# Altium schematic sheet Audio.SchDoc
size A4; Revision: B.2
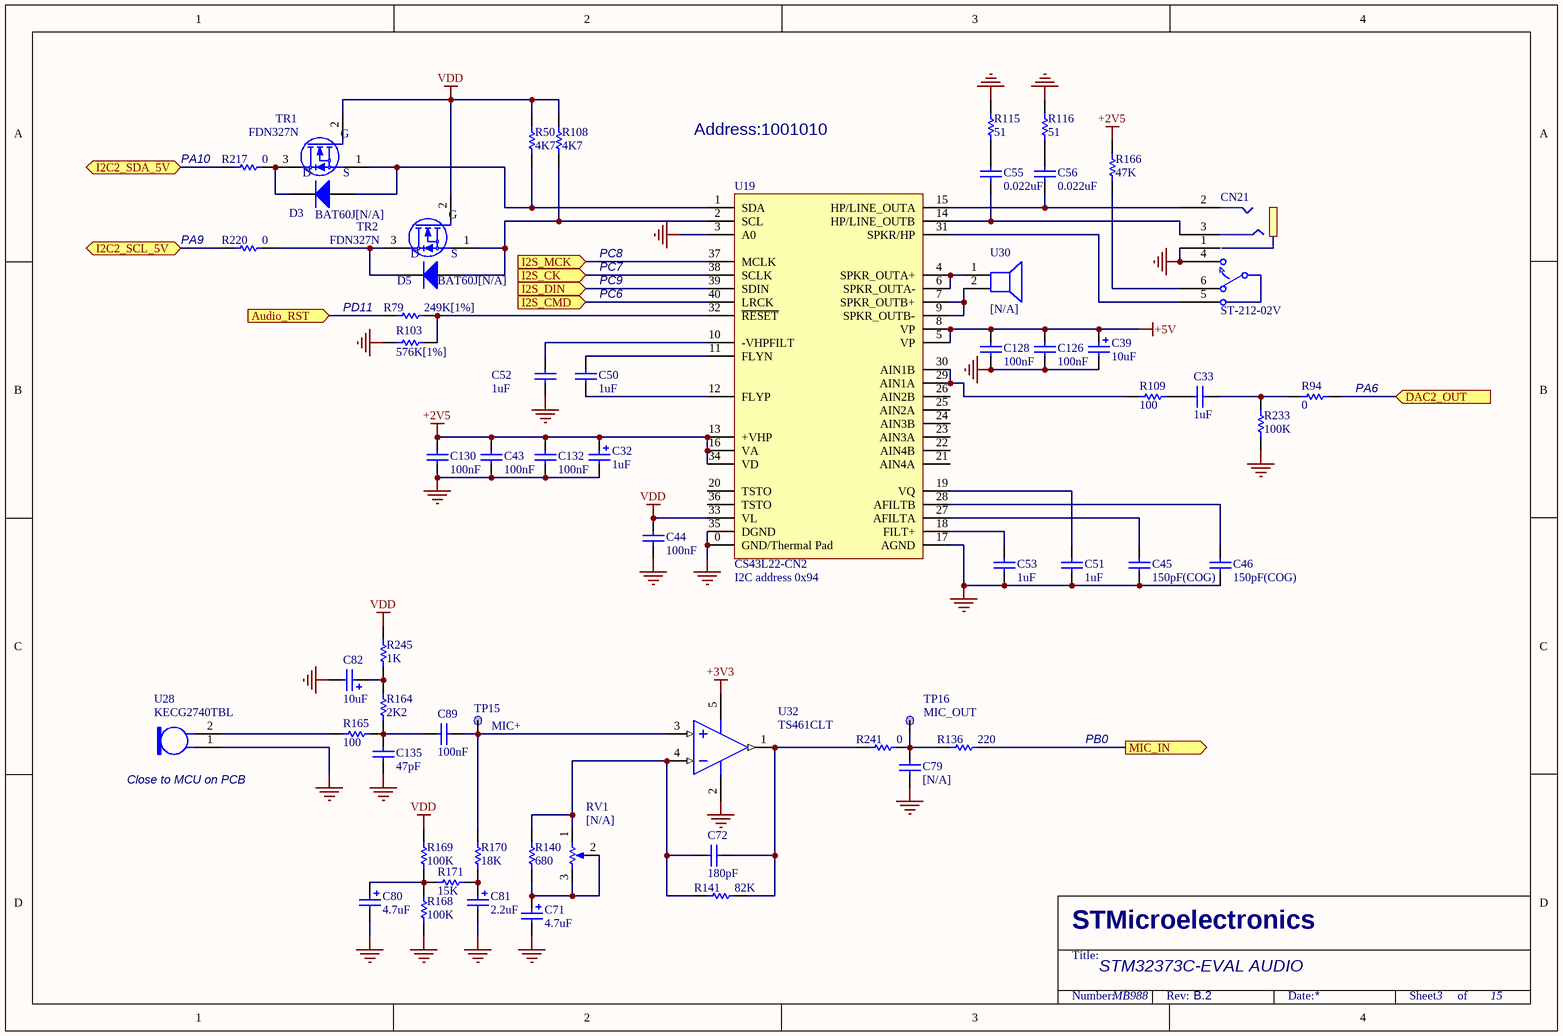
[diagram p0: Audio.SchDoc]

## Parts
C32  1uF  [TAN-A]
C33  1uF  [0603C]
C39  10uF  [TAN-A]
C43  100nF  [0603C]
C44  100nF  [0603C]
C45  150pF(COG)  [0603C]
C46  150pF(COG)  [0603C]
C50  1uF  [0603C]
C51  1uF  [0603C]
C52  1uF  [0603C]
C53  1uF  [0603C]
C55  0.022uF  [0603C]
C56  0.022uF  [0603C]
C71  4.7uF  [TAN-A]
C72  180pF  [0603C]
C79  [N/A]  [0603C]
C80  4.7uF  [TAN-A]
C81  2.2uF  [0805C]
C82  10uF  [TAN-A]
C89  100nF  [0603C]
C126  100nF  [0603C]
C128  100nF  [0603C]
C130  100nF  [0603C]
C132  100nF  [0603C]
C135  47pF  [0603C]
CN21  ST-212-02V  [ST-212-02V]
D3  BAT60J[N/A]  [SOD-323]
D5  BAT60J[N/A]  [SOD-323]
R50  4K7  [0603R]
R79  249K[1%]  [0603R]
R94  0  [0603R]
R103  576K[1%]  [0603R]
R108  4K7  [0603R]
R109  100  [0603R]
R115  51  [0603R]
R116  51  [0603R]
R136  220  [0603R]
R140  680  [0603R]
R141  82K  [0603R]
R164  2K2  [0603R]
R165  100  [0603R]
R166  47K  [0603R]
R168  100K  [0603R]
R169  100K  [0603R]
R170  18K  [0603R]
R171  15K  [0603R]
R217  0  [0603R]
R220  0  [0603R]
R233  100K  [0603R]
R241  0  [0603R]
R245  1K  [0603R]
RV1  [N/A]  [3314-J]
TP15  MIC+  [TP]
TP16  MIC_OUT  [TP]
TR1  FDN327N  [SOT-23]
TR2  FDN327N  [SOT-23]
U19  CS43L22-CN2  [QFN40(6*6)]
U28  KECG2740TBL  [KEC2740]
U30  [N/A]  [KS1708]
U32  TS461CLT  [SOT-23-5L]

## Ports
Audio_RST (in), DAC2_OUT (in), I2C2_SCL_5V (bidir), I2C2_SDA_5V (bidir), I2S_CK (in), I2S_CMD (in), I2S_DIN (in), I2S_MCK (in), MIC_IN (out)

## Nets
+2V5: C32.1 C43.1 C130.1 C132.1 R166.1 U19.13(+VHP) U19.16(VA) U19.34(VD)
+3V3: U32.5(VCC)
+5V: C39.1 C126.1 C128.1 U19.5(VP) U19.8(VP)
GND: C32.2 C39.2 C43.2 C44.2 C45.1 C46.1 C51.1 C52.2 C53.1 C71.2 C79.2 C80.2 C81.2 C82.2 C126.2 C128.2 C130.2 C132.2 C135.2 CN21.1 CN21.4 R103.1 R115.1 R116.1 R168.2 R233.2 U19.0(GND/Thermal_Pad) U19.3(A0) U19.17(AGND) U19.35(DGND) U28.1 U32.2(VDD)
VDD: C44.1 R50.2 R108.2 R169.1 R245.2 TR1.2(G) TR2.2(G) U19.33(VL)
Audio_RST: R79.2 ; port Audio_RST
DAC2_OUT: R94.2 ; port DAC2_OUT
I2C2_SCL_5V: R220.1 ; port I2C2_SCL_5V
I2C2_SDA_5V: R217.1 ; port I2C2_SDA_5V
I2S_CK: U19.38(SCLK) ; port I2S_CK
I2S_CMD: U19.40(LRCK) ; port I2S_CMD
I2S_DIN: U19.39(SDIN) ; port I2S_DIN
I2S_MCK: U19.37(MCLK) ; port I2S_MCK
MIC_IN: R136.1 ; port MIC_IN
NetC33_1: C33.1 R109.1
NetC33_2: C33.2 R94.1 R233.1
NetC45_2: C45.2 U19.27(AFILTA)
NetC46_2: C46.2 U19.28(AFILTB)
NetC50_1: C50.1 U19.12(FLYP)
NetC50_2: C50.2 U19.11(FLYN)
NetC51_2: C51.2 U19.19(VQ)
NetC52_1: C52.1 U19.10(-VHPFILT)
NetC53_2: C53.2 U19.18(FILT+)
NetC55_1: C55.1 R115.2
NetC55_2: C55.2 CN21.3 U19.14(HP/LINE_OUTB)
NetC56_1: C56.1 R116.2
NetC56_2: C56.2 CN21.2 U19.15(HP/LINE_OUTA)
NetC71_1: C71.1 R140.2 RV1.2(TAP) RV1.3(TOP)
NetC72_1: C72.1 R140.1 R141.2 RV1.1(BOT) U32.4(IN-)
NetC72_2: C72.2 R141.1 R241.2 U32.1(OUT)
NetC79_1: C79.1 R136.2 R241.1 TP16.1
NetC80_1: C80.1 R168.1 R169.2 R171.1
NetC81_1: C81.1 R170.1 R171.2
NetC82_1: C82.1 R164.2 R245.1
NetC89_1: C89.1 C135.1 R164.1 R165.1
NetC89_2: C89.2 R170.2 TP15.1 U32.3(IN+)
NetCN21_5: CN21.5 U19.31(SPKR/HP)
NetCN21_6: CN21.6 R166.2
NetD3_1: D3.1(A) R50.1 TR1.1(S) U19.1(SDA)
NetD3_2: D3.2(K) R217.2 TR1.3(D)
NetD5_1: D5.1(A) R108.1 TR2.1(S) U19.2(SCL)
NetD5_2: D5.2(K) R220.2 TR2.3(D)
NetR79_1: R79.1 R103.2 U19.32(~{RESET})
NetR109_2: R109.2 U19.29(AIN1A) U19.30(AIN1B)
NetR165_2: R165.2 U28.2
NetU19_4: U19.4(SPKR_OUTA+) U19.6(SPKR_OUTA-) U30.1(+)
NetU19_7: U19.7(SPKR_OUTB+) U19.9(SPKR_OUTB-) U30.2(-)

Not connected (* = marked no-connect by the designer): U19 20(TSTO) 21(AIN4A) 22(AIN4B) 23(AIN3A) 24(AIN3B) 25(AIN2A) 26(AIN2B) 36(TSTO)

## Notes on the sheet
- (near R217) PA10
- Address:1001010
- (near R220) PA9
- PD11
- PC8
- PC9
- PC6
- PC7
- (near R94) PA6
- (near U19) I2C address 0x94
- (near U28) Close to MCU on PCB
- PB0
- STM32373C-EVAL AUDIO
- MB988
- 3
- 15
- STMicroelectronics
- Title:
- Number:
- Rev:
- Date:
- Sheet       of

## Library data of the parts
C32 = Cap Pol1: Polarized Capacitor (Radial); Value: 47uF; Published: 8-Jun-2000; Revision: July-2002: Re-released for DXP Platform.; Publisher: Altium Limited
C33 C45 C46 C50-C53 C55 C56 C79 = CAP: Capacitor; Value: 100nF; Published: 8-Jun-2000; Revision: July-2002: Re-released for DXP Platform.; Publisher: Altium Limited
C39 = Cap Pol1: Polarized Capacitor (Radial); Published: 8-Jun-2000; Revision: July-2002: Re-released for DXP Platform.; Publisher: Altium Limited; Value: 10uF
C43 C44 C126 C128 C130 C132 = Cap: Capacitor; Value: 10nF; Published: 8-Jun-2000; Revision: July-2002: Re-released for DXP Platform.; Publisher: Altium Limited
C71 C80-C82 = Cap Pol1: Polarized Capacitor (Radial); Value: 100pF; Published: 8-Jun-2000; Revision: July-2002: Re-released for DXP Platform.; Publisher: Altium Limited
C72 C89 C135 = CAP: Capacitor; Value: 100pF; Published: 8-Jun-2000; Revision: July-2002: Re-released for DXP Platform.; Publisher: Altium Limited
D3 D5 = Diode: Default Diode; Code - JEDEC: DO-214-AB; Published: 8-Jun-2000; Revision: July-2002: Re-released for DXP Platform.; Publisher: Altium Limited
R50 R108 R136 R140 R141 R164 R165 R168-R171 R217 R220 R241 = Res1: Resistor; Value: 1K; Published: 8-Jun-2000; Revision: July-2002: Re-released for DXP Platform.; Publisher: Altium Limited
R79 R94 R103 R109 R115 R116 R166 R233 = res1: Resistor; Value: 1K; Published: 8-Jun-2000; Revision: July-2002: Re-released for DXP Platform.; Publisher: Altium Limited
R245 = Res1: Resistor; Published: 8-Jun-2000; Revision: July-2002: Re-released for DXP Platform.; Publisher: Altium Limited; Value: 1K
RV1 = RV
TP15 TP16 = TP
TR1 TR2 = 2N7000
U19 = CS43L22
U28 = Mic2: Microphone; Published: 24-Mar-1999; Revision: July-2002: Re-released for DXP Platform.; Publisher: Altium Limited
U30 = Speaker: Loudspeaker; Published: 24-Mar-1999; Revision: July-2002: Re-released for DXP Platform.; Publisher: Altium Limited